# Altium schematic sheet lcd.SchDoc: 7'' LCD display with PCAP
size A3; Author: Daniele Basile <asterix@develer.com>; Organization: Develer s.r.l.; Address1: Via San Quirico 233/2; Address2: 50013 Campi Bisenzio; Address3: Firenze; Address4: ITALY; Revision: A; SheetNumber: 1; SheetTotal: 1; Hw_rev: R1
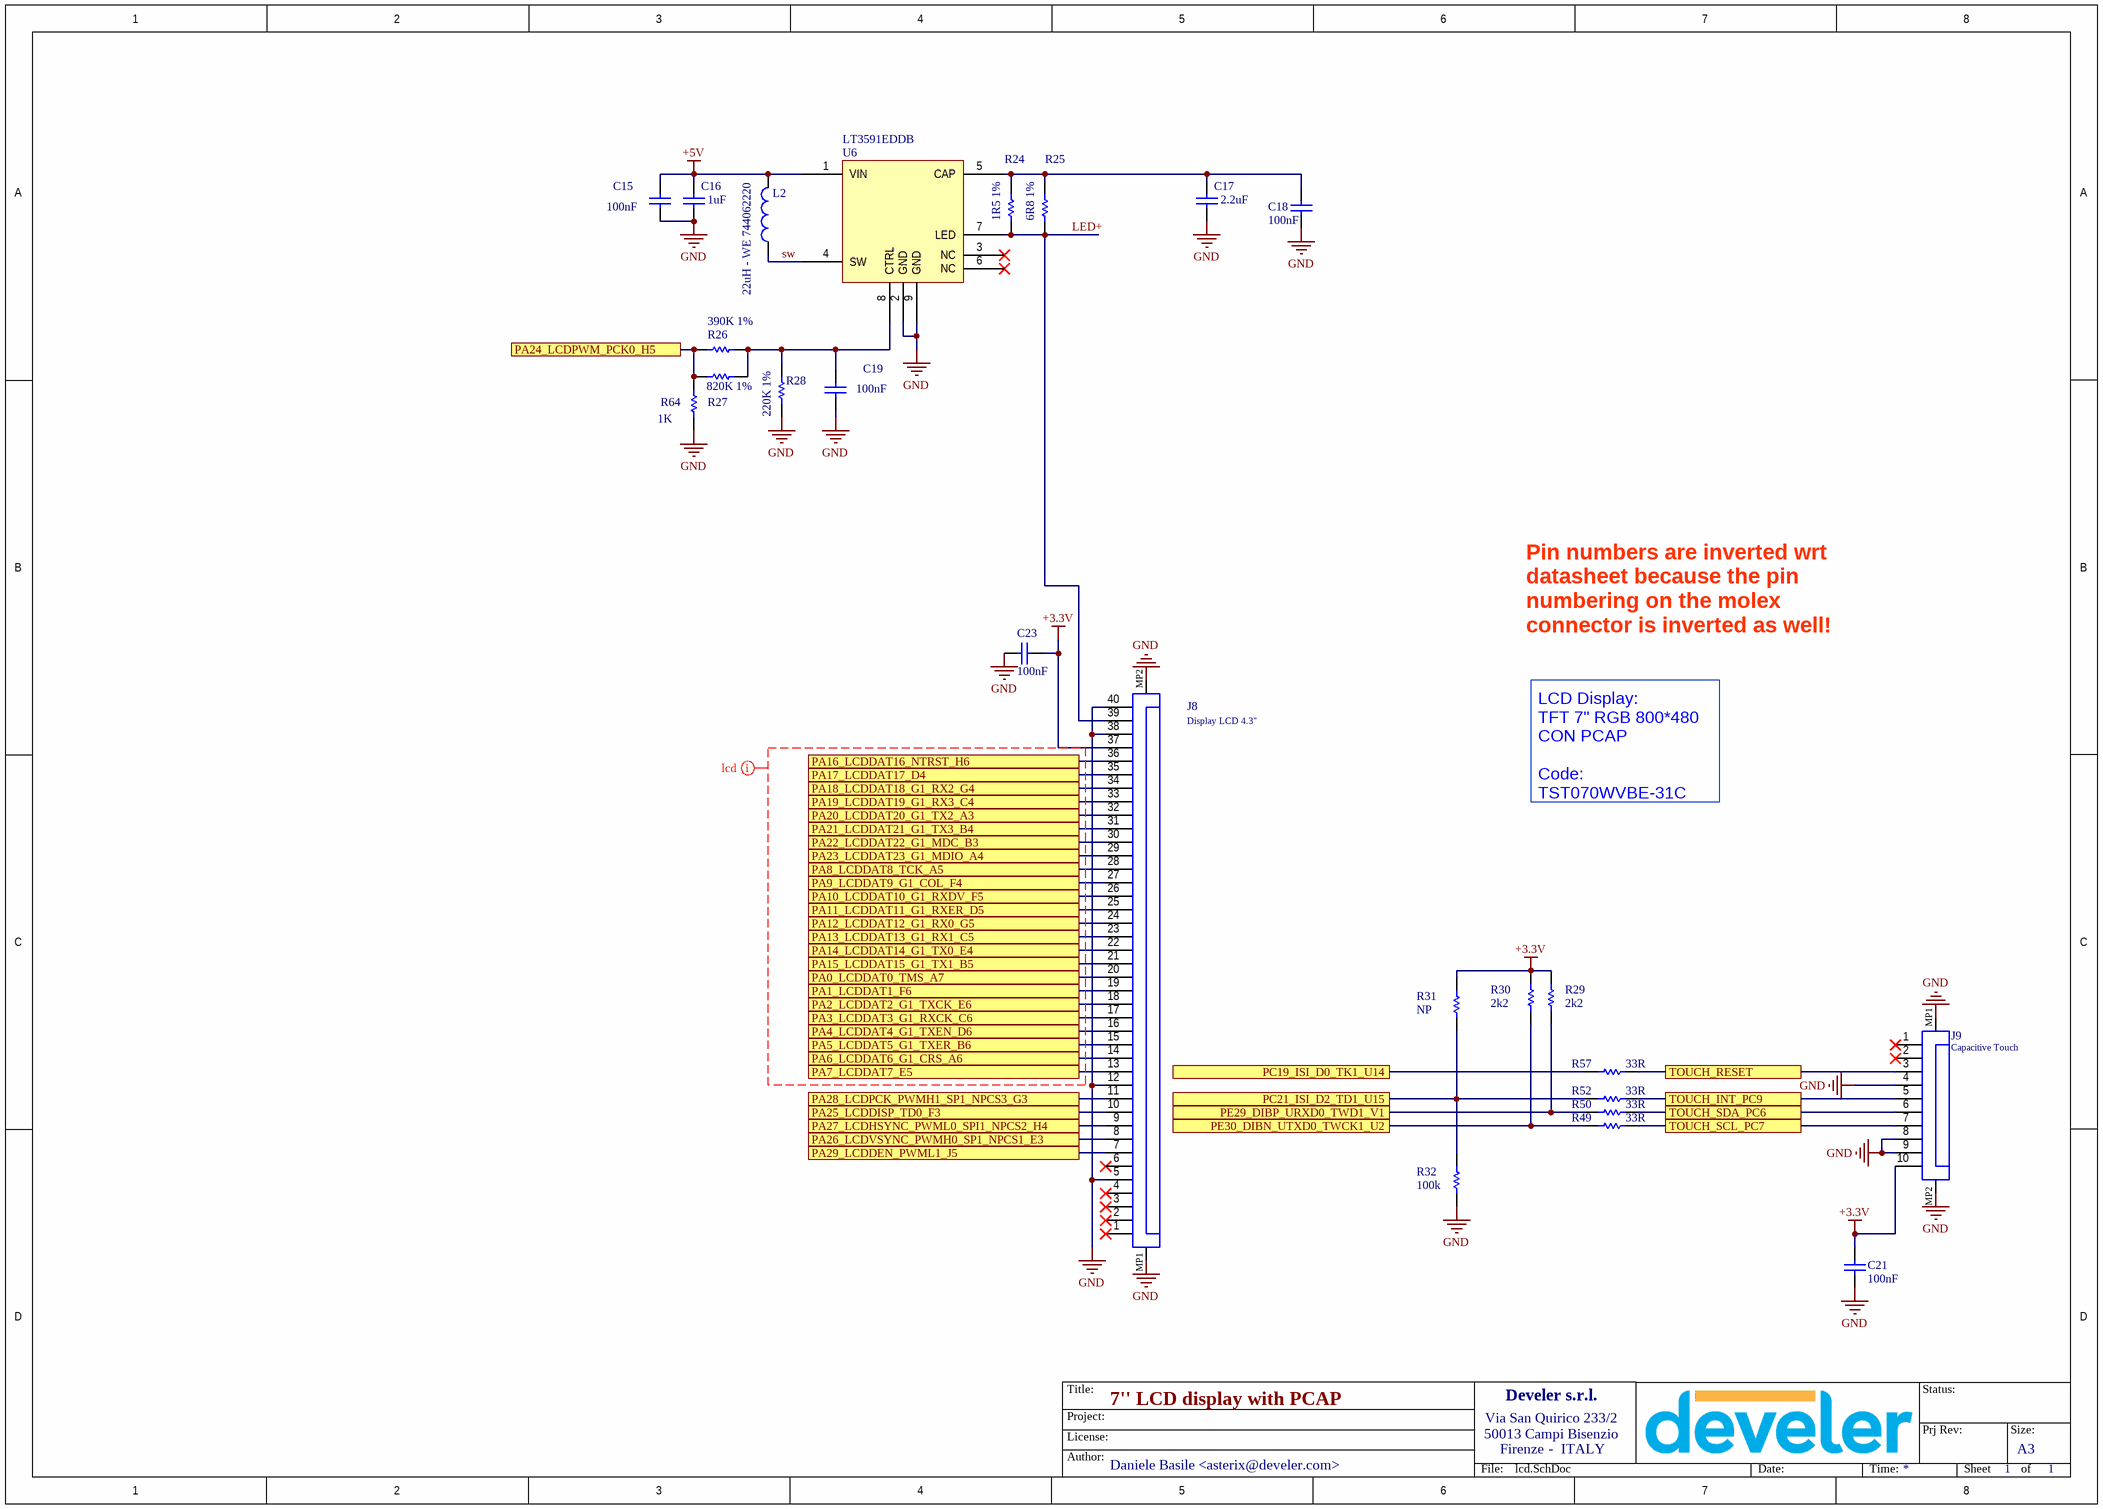
[diagram p0: lcd.SchDoc]

## Parts
C15  100nF  [0603_[1608]]
C16  1uF  [0603_[1608]]
C17  2.2uF  [1210_[3225]]
C18  100nF  [0603_[1608]]
C19  100nF  [0603_[1608]]
C21  100nF  [0603_[1608]]
C23  100nF  [0603_[1608]]
J8  Display LCD 4.3''  [FCC-ZIF_40PIN_0.5MM_TOP_LOWPROFILE]
J9  Capacitive Touch  [FCC-ZIF_10PIN_0.5MM_LOW_PROFILE]
L2  22uH - WE 744062220  [WE-TPC-6823-X]
R24  1R5 1%  [0603_[1608]]
R25  6R8 1%  [0603_[1608]]
R26  390K 1%  [0603_[1608]]
R27  820K 1%  [0603_[1608]]
R28  220K 1%  [0603_[1608]]
R29  2k2  [0603_[1608]]
R30  2k2  [0603_[1608]]
R31  NP  [0603_[1608]]
R32  100k  [0603_[1608]]
R49  33R  [0603_[1608]]
R50  33R  [0603_[1608]]
R52  33R  [0603_[1608]]
R57  33R  [0603_[1608]]
R64  1K  [0603_[1608]]
U6  LT3591EDDB  [PQFN50P300X200X75_HS-9L]

## Ports
PA0_LCDDAT0_TMS_A7, PA1_LCDDAT1_F6, PA2_LCDDAT2_G1_TXCK_E6, PA3_LCDDAT3_G1_RXCK_C6, PA4_LCDDAT4_G1_TXEN_D6, PA5_LCDDAT5_G1_TXER_B6, PA6_LCDDAT6_G1_CRS_A6, PA7_LCDDAT7_E5, PA8_LCDDAT8_TCK_A5, PA9_LCDDAT9_G1_COL_F4, PA10_LCDDAT10_G1_RXDV_F5, PA11_LCDDAT11_G1_RXER_D5, PA12_LCDDAT12_G1_RX0_G5, PA13_LCDDAT13_G1_RX1_C5, PA14_LCDDAT14_G1_TX0_E4, PA15_LCDDAT15_G1_TX1_B5, PA16_LCDDAT16_NTRST_H6, PA17_LCDDAT17_D4, PA18_LCDDAT18_G1_RX2_G4, PA19_LCDDAT19_G1_RX3_C4, PA20_LCDDAT20_G1_TX2_A3, PA21_LCDDAT21_G1_TX3_B4, PA22_LCDDAT22_G1_MDC_B3, PA23_LCDDAT23_G1_MDIO_A4, PA24_LCDPWM_PCK0_H5, PA25_LCDDISP_TD0_F3, PA26_LCDVSYNC_PWMH0_SP1_NPCS1_E3, PA27_LCDHSYNC_PWML0_SPI1_NPCS2_H4, PA28_LCDPCK_PWMH1_SP1_NPCS3_G3, PA29_LCDDEN_PWML1_J5, PC19_ISI_D0_TK1_U14, PC21_ISI_D2_TD1_U15, PE29_DIBP_URXD0_TWD1_V1, PE30_DIBN_UTXD0_TWCK1_U2, TOUCH_INT_PC9, TOUCH_RESET, TOUCH_SCL_PC7, TOUCH_SDA_PC6

## Nets
+3.3V: C21.1 C23.1 J8.37 J9.10 R29.1 R30.1 R31.1
+5V: C15.2 C16.2 L2.2 U6.1(VIN)
GND: C15.1 C16.1 C17.1 C18.1 C19.1 C21.2 C23.2 J8.5 J8.12 J8.38 J8.40 J8.MP1 J8.MP2 J9.4 J9.8 J9.9 J9.MP1 J9.MP2 R28.2 R32.2 R64.2 U6.2(GND) U6.9(GND)
LED+: J8.39 R24.1 R25.1 U6.7(LED)
PA0_LCDDAT0_TMS_A7: J8.20 ; port PA0_LCDDAT0_TMS_A7
PA1_LCDDAT1_F6: J8.19 ; port PA1_LCDDAT1_F6
PA2_LCDDAT2_G1_TXCK_E6: J8.18 ; port PA2_LCDDAT2_G1_TXCK_E6
PA3_LCDDAT3_G1_RXCK_C6: J8.17 ; port PA3_LCDDAT3_G1_RXCK_C6
PA4_LCDDAT4_G1_TXEN_D6: J8.16 ; port PA4_LCDDAT4_G1_TXEN_D6
PA5_LCDDAT5_G1_TXER_B6: J8.15 ; port PA5_LCDDAT5_G1_TXER_B6
PA6_LCDDAT6_G1_CRS_A6: J8.14 ; port PA6_LCDDAT6_G1_CRS_A6
PA7_LCDDAT7_E5: J8.13 ; port PA7_LCDDAT7_E5
PA8_LCDDAT8_TCK_A5: J8.28 ; port PA8_LCDDAT8_TCK_A5
PA9_LCDDAT9_G1_COL_F4: J8.27 ; port PA9_LCDDAT9_G1_COL_F4
PA10_LCDDAT10_G1_RXDV_F5: J8.26 ; port PA10_LCDDAT10_G1_RXDV_F5
PA11_LCDDAT11_G1_RXER_D5: J8.25 ; port PA11_LCDDAT11_G1_RXER_D5
PA12_LCDDAT12_G1_RX0_G5: J8.24 ; port PA12_LCDDAT12_G1_RX0_G5
PA13_LCDDAT13_G1_RX1_C5: J8.23 ; port PA13_LCDDAT13_G1_RX1_C5
PA14_LCDDAT14_G1_TX0_E4: J8.22 ; port PA14_LCDDAT14_G1_TX0_E4
PA15_LCDDAT15_G1_TX1_B5: J8.21 ; port PA15_LCDDAT15_G1_TX1_B5
PA16_LCDDAT16_NTRST_H6: J8.36 ; port PA16_LCDDAT16_NTRST_H6
PA17_LCDDAT17_D4: J8.35 ; port PA17_LCDDAT17_D4
PA18_LCDDAT18_G1_RX2_G4: J8.34 ; port PA18_LCDDAT18_G1_RX2_G4
PA19_LCDDAT19_G1_RX3_C4: J8.33 ; port PA19_LCDDAT19_G1_RX3_C4
PA20_LCDDAT20_G1_TX2_A3: J8.32 ; port PA20_LCDDAT20_G1_TX2_A3
PA21_LCDDAT21_G1_TX3_B4: J8.31 ; port PA21_LCDDAT21_G1_TX3_B4
PA22_LCDDAT22_G1_MDC_B3: J8.30 ; port PA22_LCDDAT22_G1_MDC_B3
PA23_LCDDAT23_G1_MDIO_A4: J8.29 ; port PA23_LCDDAT23_G1_MDIO_A4
PA24_LCDPWM_PCK0_H5: R26.2 R27.1 R64.1 ; port PA24_LCDPWM_PCK0_H5
PA25_LCDDISP_TD0_F3: J8.10 ; port PA25_LCDDISP_TD0_F3
PA26_LCDVSYNC_PWMH0_SP1_NPCS1_E3: J8.8 ; port PA26_LCDVSYNC_PWMH0_SP1_NPCS1_E3
PA27_LCDHSYNC_PWML0_SPI1_NPCS2_H4: J8.9 ; port PA27_LCDHSYNC_PWML0_SPI1_NPCS2_H4
PA28_LCDPCK_PWMH1_SP1_NPCS3_G3: J8.11 ; port PA28_LCDPCK_PWMH1_SP1_NPCS3_G3
PA29_LCDDEN_PWML1_J5: J8.7 ; port PA29_LCDDEN_PWML1_J5
PC19_ISI_D0_TK1_U14: R57.2 ; port PC19_ISI_D0_TK1_U14
PC21_ISI_D2_TD1_U15: R31.2 R32.1 R52.2 ; port PC21_ISI_D2_TD1_U15
PE29_DIBP_URXD0_TWD1_V1: R29.2 R50.2 ; port PE29_DIBP_URXD0_TWD1_V1
PE30_DIBN_UTXD0_TWCK1_U2: R30.2 R49.2 ; port PE30_DIBN_UTXD0_TWCK1_U2
sw: L2.1 U6.4(SW)
TOUCH_INT_PC9: J9.5 R52.1 ; port TOUCH_INT_PC9
TOUCH_RESET: J9.3 R57.1 ; port TOUCH_RESET
TOUCH_SCL_PC7: J9.7 R49.1 ; port TOUCH_SCL_PC7
TOUCH_SDA_PC6: J9.6 R50.1 ; port TOUCH_SDA_PC6
NetC17_2: C17.2 C18.2 R24.2 R25.2 U6.5(CAP)
NetC19_2: C19.2 R26.1 R27.2 R28.1 U6.8(CTRL)

Not connected (* = marked no-connect by the designer): J8 1* 2* 3* 4* 6*; J9 1* 2*; U6 3(NC)* 6(NC)*

## Layout directives
net class lcd: (no net found under the mark)

## Notes on the sheet
- Pin numbers are inverted wrt datasheet because the pin numbering on the molex connector is inverted as well!
- LCD Display:
  TFT 7" RGB 800*480 CON PCAP
  Code: TST070WVBE-31C
- Title:
- Status:
- Author:
- License:
- Project:
- -
- Prj Rev:
- Size:
- A3
- File:
- Date:
- Time:
- Sheet
- of

## Library data of the parts
C15 C18 C19 C21 C23 = Cap: Ceramic X7R 50V; Value: 10nF; Published: 8-Jun-2000; Revision: July-2002: Re-released for DXP Platform.; Publisher: Altium Limited
C16 = Cap: Ceramic X7R, X5R 16V; Value: 10nF; Published: 8-Jun-2000; Revision: July-2002: Re-released for DXP Platform.; Publisher: Altium Limited
C17 = Cap: Ceramic X7R, X5R 50V; Value: 10nF; Published: 8-Jun-2000; Revision: July-2002: Re-released for DXP Platform.; Publisher: Altium Limited
J8 = FPC-ZIF_40PIN_1MM: Connectors, FPC, SMT ZIF, Low Profile, Horizontal, Top Contact, pitch 0.5 mm, 40 pins (WE 687140183622); Rated Current: 0.4 A; Contact Resistance: 30 mOhm; Withstanding Voltage: 250 VAC; Working Voltage: 50 VAC; Pin Number: 40; Pitch: 0.5 mm; ComponentLink1Description: Manufacturer; ComponentLink1URL: http://www.we-online.de; ComponentLink2Description: Datasheet; ComponentLink2URL: https://katalog.we-online.de/em/datasheet/687140183622.pdf; Part Number: 687140183622; Published Date: August 2018; Publisher: Wurth Elektronik; Operating Temperature: -25 to 85 degC; Packaging: Tape and Reel; Mounting Technology: SMT; Orientation: Horizontal; Contact Design: Top Contact
J9 = FPC-ZIF_10PIN_0.5MM: SMT ZIF Connectors Low Profile WR-FPC, Horizontal, BOT Contact, pitch 0.5 mm, 10 pins; Part Number: 687110183722; Rated Current: 0.4 A; Contact Resistance: 30 mOhm; Withstanding Voltage: 250 VAC; Working Voltage: 50 VAC; Pin Number: 10; Pitch: 0.5 mm; Contact Design: Bottom Contact; ComponentLink1Description: Manufacturer; ComponentLink1URL: http://www.we-online.de; ComponentLink2Description: Datasheet; ComponentLink2URL: https://katalog.we-online.de/em/datasheet/687110183722.pdf; Published Date: August 2018; Publisher: Wurth Elektronik; Operating Temperature: -25 to 85 degC; Packaging: Tape and Reel; Mounting Technology: SMT; Orientation: Horizontal
L2 = Inductor: Power Inductor
R24 R25 R29-R32 = Res1: Resistor 0.125W; Value: 1K; Published: 8-Jun-2000; Revision: July-2002: Re-released for DXP Platform.; Publisher: Altium Limited
R26-R28 R49 R50 R52 R57 = Res1: Resistor; Value: 1K; Published: 8-Jun-2000; Revision: July-2002: Re-released for DXP Platform.; Publisher: Altium Limited
R64 = Res1: Resistor; Published: 8-Jun-2000; Revision: July-2002: Re-released for DXP Platform.; Publisher: Altium Limited; Value: 1K
U6 = LT3591: White LED Driver with Integrated Schottky